# EAGLE design esp_car (EAGLE 9.0.1)
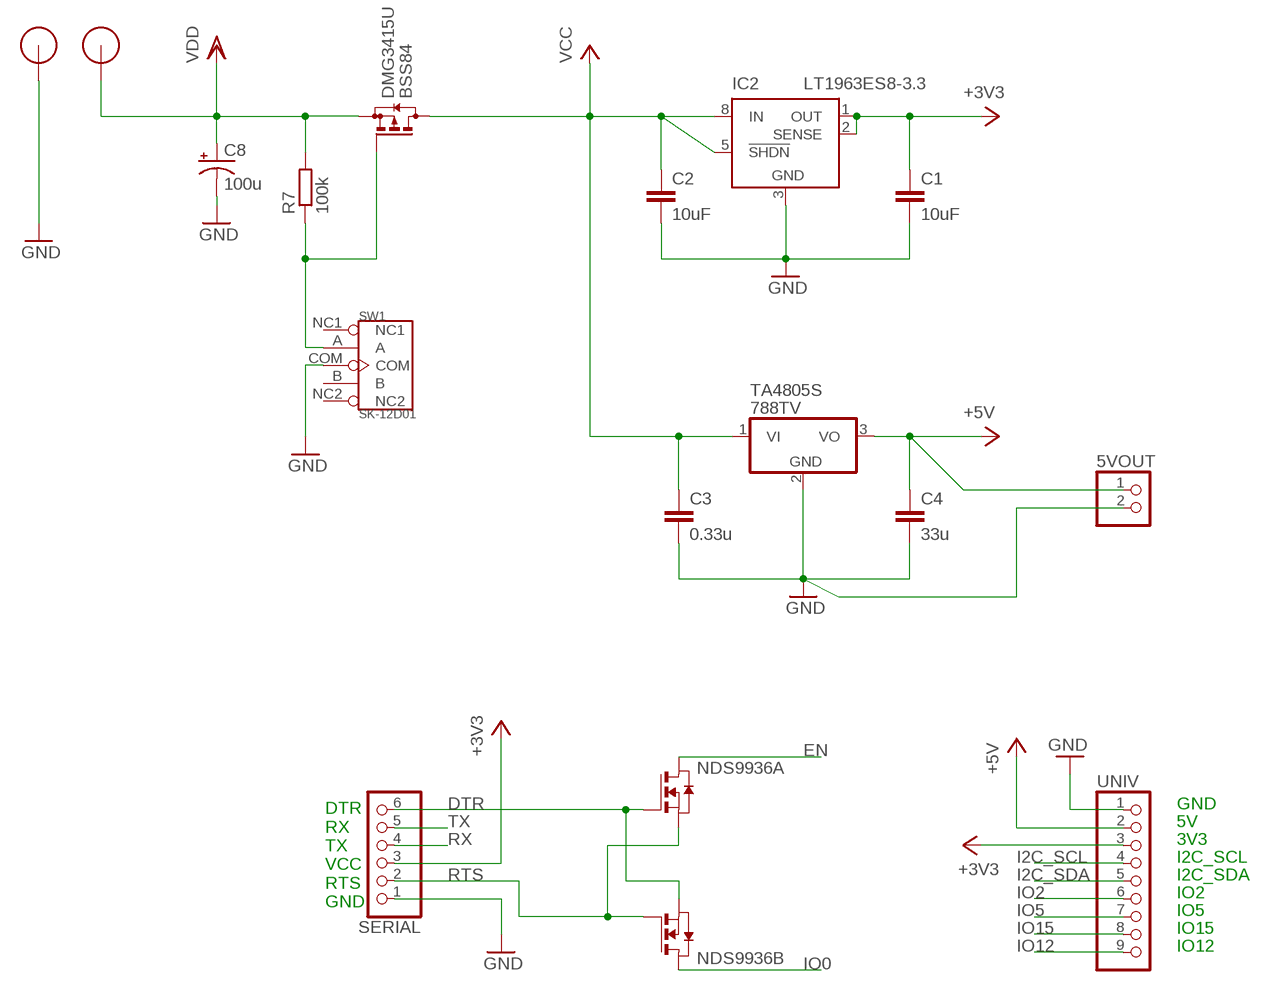
[diagram p0: schematic, sheet 1, part 1 of 2]
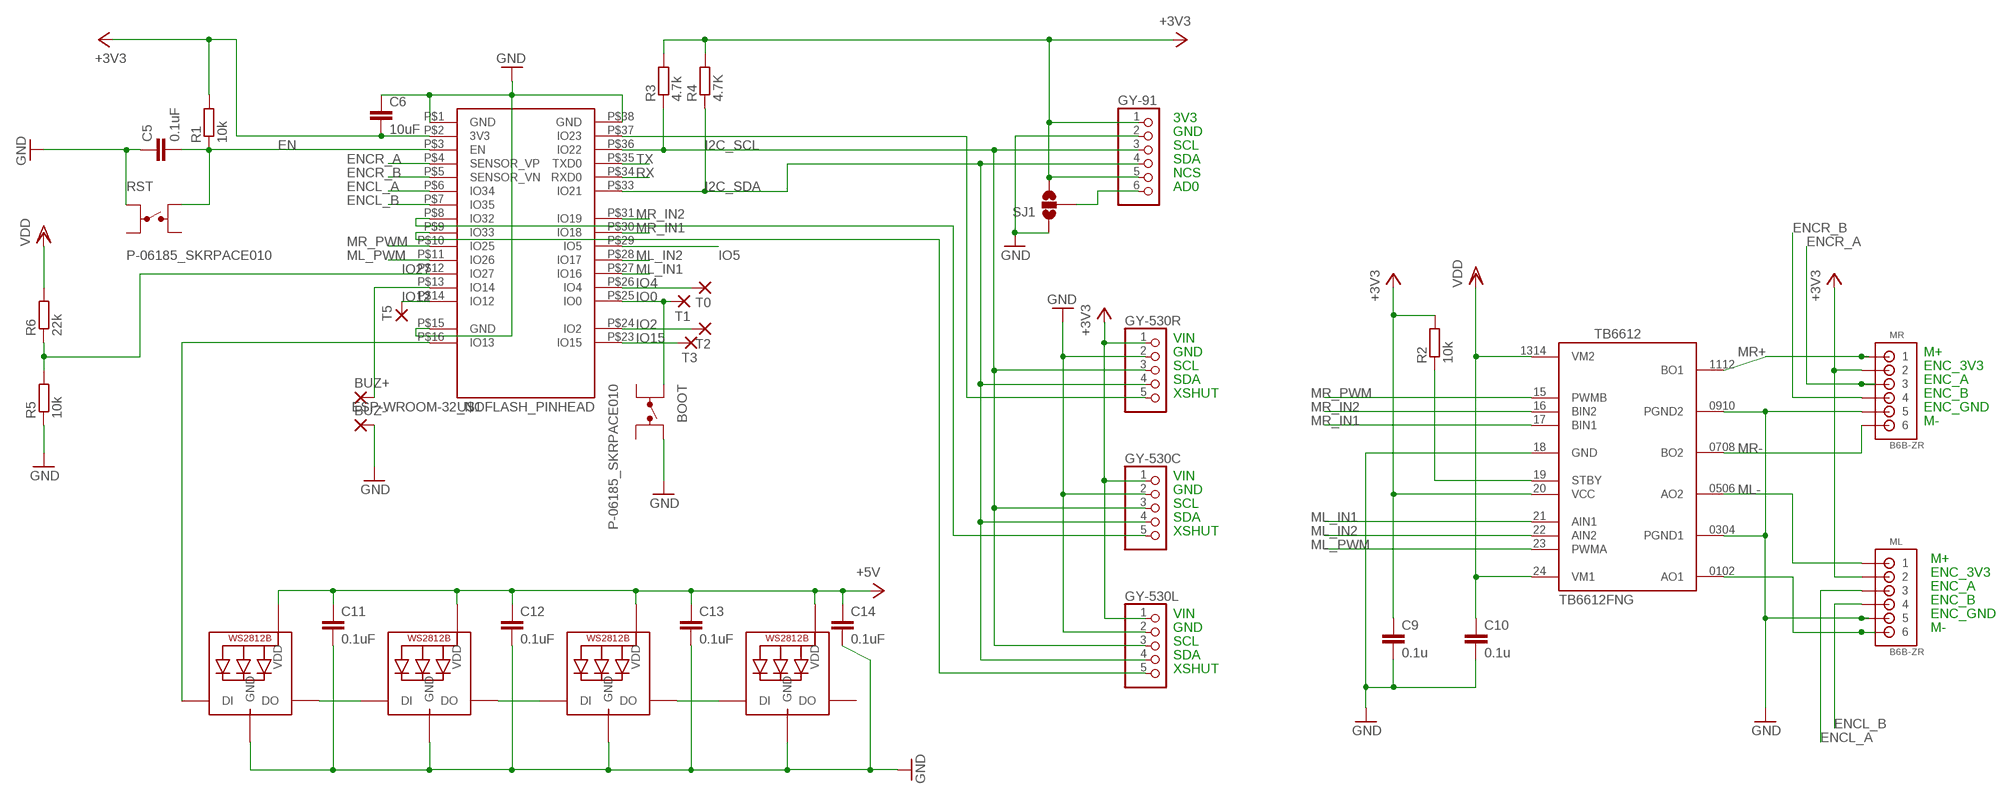
[diagram p1: schematic, sheet 1, part 2 of 2]

## Parts
5VOUT  PINHD-1X2  [1X02]
BOOT  P-06185_SKRPACE010  [SKRP]
BUZ+  SMD2  [SMD1,27-2,54]
BUZ-  SMD2  [SMD1,27-2,54]
C1  10uF  C-EUC1608  [C1608]
C2  10uF  C-EUC1608  [C1608]
C3  0.33u  C-EUC1608  [C1608]
C4  33u  C-EUC3225  [C3225]
C5  0.1uF  C-EUC1608  [C1608]
C6  10uF  C-EUC1608  [C1608]
C8  100u  CPOL-USE2.5-6  [E2,5-6]
C9  0.1u  C-EUC1608  [C1608]
C10  0.1u  C-EUC1608  [C1608]
C11  0.1uF  C-EUC1608  [C1608]
C12  0.1uF  C-EUC1608  [C1608]
C13  0.1uF  C-EUC1608  [C1608]
C14  0.1uF  C-EUC1608  [C1608]
DMG3415U  BSS84  [SOT23]
GY-91  PINHD-1X6  [1X06]
GY-530C  PINHD-1X5  [1X05]
GY-530L  PINHD-1X5  [1X05]
GY-530R  PINHD-1X5  [1X05]
IC2  LT1963ES8-3.3  [SOIC8]
LED_FL  WS2812B5050  [WS2812B]
LED_FR  WS2812B5050  [WS2812B]
LED_RL  WS2812B5050  [WS2812B]
LED_RR  WS2812B5050  [WS2812B]
ML  B6B-ZR  [B6B-ZR]
MR  B6B-ZR  [B6B-ZR]
NDS9936  NMOS2SO8  [SO8]
R1  10k  R-EU_R0603  [R0603]
R2  10k  R-EU_R0603  [R0603]
R3  4.7k  R-EU_R0603  [R0603]
R4  4.7K  R-EU_R0603  [R0603]
R5  10k  R-EU_R0603  [R0603]
R6  22k  R-EU_R0603  [R0603]
R7  100k  R-EU_R0603  [R0603]
RST  P-06185_SKRPACE010  [SKRP]
SERIAL  PINHD-1X6  [1X06]
SJ1  SOLDERJUMPER_2WAYS  [SJ_3]
SW1  SK-12D01  DIP-TOGGLE-SWITCH-ON-ON(3+2P-8.8X4.6MM)  [SW5-2.0-8.8X4.4X4.7MM-90D]
T0  SMD5  [SMD2,54-5,08]
T1  SMD5  [SMD2,54-5,08]
T2  SMD5  [SMD2,54-5,08]
T3  SMD5  [SMD2,54-5,08]
T5  SMD5  [SMD2,54-5,08]
TA4805S  788TV  [TO220V]
TB6612  TB6612_NEW  [SSOP24_TB6612]
U$1  ESP-WROOM-32_NOFLASH_PINHEAD  [ESP-WROOM-32_NOFLASH_PINHEAD]
U$5  2.0  [2.0]
U$7  2.0  [2.0]
UNIV  PINHD-1X9  [1X09-BIG]

## Nets
+3V3 [L]: C1.1 C6.2 C9.1 GY-91.1 GY-91.5 GY-530C.1 GY-530L.1 GY-530R.1 IC2.1(OUT) IC2.2(SENSE) ML.2 MR.2 R1.2 R2.2 R3.2 R4.2 SERIAL.3 SJ1.3 TB6612.20(VCC) U$1.P$2(3V3) UNIV.3
+5V [L]: 5VOUT.1 C4.1 C11.1 C12.1 C13.1 C14.1 LED_FL.1-VDD(VDD) LED_FR.1-VDD(VDD) LED_RL.1-VDD(VDD) LED_RR.1-VDD(VDD) TA4805S.3(VO) UNIV.2
DTR: NDS9936.2(A:G) NDS9936.3(B:S) SERIAL.6
EN: C5.2 NDS9936.7(A:D) NDS9936.8(A:D) R1.1 RST.2A(P$2A) U$1.P$3(EN)
ENCL_A: ML.3 U$1.P$6(IO34)
ENCL_B: ML.4 U$1.P$7(IO35)
ENCR_A: MR.3 U$1.P$4(SENSOR_VP)
ENCR_B: MR.4 U$1.P$5(SENSOR_VN)
GND [L]: 5VOUT.2 BOOT.2A(P$2A) BUZ-.1(P) C1.2 C2.2 C3.2 C4.2 C5.1 C6.1 C8.- C9.2 C10.2 C11.2 C12.2 C13.2 C14.2 GY-91.2 GY-530C.2 GY-530L.2 GY-530R.2 IC2.3(GND) LED_FL.3-GND(GND) LED_FR.3-GND(GND) LED_RL.3-GND(GND) LED_RR.3-GND(GND) ML.5 MR.5 R5.1 RST.1A(P$1A) SERIAL.1 SJ1.1 SW1.COM TA4805S.2(GND) TB6612.18(GND) TB6612.0304(PGND1) TB6612.0910(PGND2) U$1.P$1(GND) U$1.P$15(GND) U$1.P$38(GND) U$5.P$1 UNIV.1
I2C_SCL: GY-91.3 GY-530C.3 GY-530L.3 GY-530R.3 R3.1 U$1.P$36(IO22) UNIV.4
I2C_SDA: GY-91.4 GY-530C.4 GY-530L.4 GY-530R.4 R4.1 U$1.P$33(IO21) UNIV.5
IO0: BOOT.1A(P$1A) NDS9936.5(B:D) NDS9936.6(B:D) T1.1(P) U$1.P$25(IO0)
IO2: T2.1(P) U$1.P$24(IO2) UNIV.6
IO4: T0.1(P) U$1.P$26(IO4)
IO5: U$1.P$29(IO5) UNIV.7
IO12: T5.1(P) U$1.P$14(IO12) UNIV.9
IO15: T3.1(P) U$1.P$23(IO15) UNIV.8
IO27: R5.2 R6.1 U$1.P$12(IO27)
ML- [L]: ML.6 TB6612.0102(AO1)
ML_IN1: TB6612.21(AIN1) U$1.P$27(IO16)
ML_IN2: TB6612.22(AIN2) U$1.P$28(IO17)
ML_PWM: TB6612.23(PWMA) U$1.P$11(IO26)
MR+ [L]: MR.1 TB6612.1112(BO1)
MR- [L]: MR.6 TB6612.0708(BO2)
MR_IN1: TB6612.17(BIN1) U$1.P$30(IO18)
MR_IN2: TB6612.16(BIN2) U$1.P$31(IO19)
MR_PWM: TB6612.15(PWMB) U$1.P$10(IO25)
N$3: GY-530C.5 U$1.P$8(IO32)
N$4: GY-91.6 SJ1.2
N$5: GY-530R.5 U$1.P$37(IO23)
N$6: LED_FL.2-DOUT(DO) LED_RL.4-DIN(DI)
N$7: R2.1 TB6612.19(STBY)
N$8: BUZ+.1(P) U$1.P$13(IO14)
N$9: LED_RL.2-DOUT(DO) LED_RR.4-DIN(DI)
N$15: LED_FR.4-DIN(DI) LED_RR.2-DOUT(DO)
N$18: LED_FL.4-DIN(DI) U$1.P$16(IO13)
N$19: GY-530L.5 U$1.P$9(IO33)
N$38: ML.1 TB6612.0506(AO2)
N$39: DMG3415U.1(G) R7.1 SW1.A
RTS: NDS9936.1(A:S) NDS9936.4(B:G) SERIAL.2
RX: SERIAL.4 U$1.P$34(RXD0)
TX: SERIAL.5 U$1.P$35(TXD0)
VCC [LL]: C2.1 C3.1 DMG3415U.3(D) IC2.5(!SHDN) IC2.8(IN) TA4805S.1(VI)
VDD [L]: C8.+ C10.1 DMG3415U.2(S) R6.2 R7.2 TB6612.24(VM1) TB6612.1314(VM2) U$7.P$1
Unconnected: BOOT.1B(P$1B) BOOT.2B(P$2B) IC2.4(NC) LED_FR.2-DOUT(DO) RST.1B(P$1B) RST.2B(P$2B) SW1.B SW1.NC1 SW1.NC2

## Notes on the sheet
- 3V3
- GND
- SCL
- SDA
- NCS
- AD0
- VIN
- GND | M+
- SCL | ENC_3V3
- SDA | ENC_A
- XSHUT | ENC_B
- ENC_GND
- M-
- VIN
- GND
- SCL
- SDA
- XSHUT
- M+
- ENC_3V3
- ENC_A
- ENC_B
- GND | VIN | ENC_GND
- 5V | GND | M-
- 3V3 | SCL
- I2C_SCL | SDA
- I2C_SDA | XSHUT
- IO2
- DTR
  RX
  TX
  VCC
  RTS
  GND
- IO5
- IO15
- IO12

## Power pins joined to a net without a drawn wire
GND: IC2.6(GND) IC2.7(GND)

## Library data of the parts
5VOUT = pinhead:PINHD-1X2: PIN HEADER
BOOT RST = Akizuki:P-06185_SKRPACE010
BUZ+ BUZ- = wirepad:SMD2: SMD PAD
C1-C6 C9-C14 = rcl:C-EU: CAPACITOR, European symbol; SPICEPREFIX: C
C8 = rcl:CPOL-US: POLARIZED CAPACITOR, American symbol
DMG3415U = transistor-small-signal:BSS84: P-CHANNEL MOS FET
GY-91 SERIAL = adafruit:PINHD-1X6: PIN HEADER
GY-530C GY-530L GY-530R = pinhead:PINHD-1X5: PIN HEADER
IC2 = linear-technology:LT1963ES8: 1.5A, Low Noise, Fast Transient Response LDO Regulator Source: http://www.linear.com/pc/downloadDocument.do?navId=H0,C3,P2222,D3148; MPN: LT1963ES8-3.3; OC_FARNELL: unknown; OC_NEWARK: 57M7563
LED_FL LED_FR LED_RL LED_RR = adafruit:WS2812B
ML MR = jst:B6B-ZR: JST-ZH Connector 6 pol, 1.5mm pitch Package: B6B-ZR Source: http://www.jst-mfg.com/product/pdf/eng/eZH.pdf
NDS9936 = zetex:NMOS2: Dual MOS FET; OC_FARNELL: unknown; OC_NEWARK: unknown
R1-R7 = rcl:R-EU_: RESISTOR, European symbol; SPICEPREFIX: R
SJ1 = SparkFun:SOLDERJUMPER_2WAY: Solder Jumper 2 way solder jumper
SW1 = Seeed-OPL-Button:DIP-TOGGLE-SWITCH-ON-ON(3+2P-8.8X4.6MM): 311030008; MPN: SK-12D01
T0 T1-T3 T5 = wirepad:SMD5: SMD PAD
TA4805S = linear:78*: Positive VOLTAGE REGULATOR Source: http://cache.national.com/ds/LM/LM78L05.pdf http://www.fairchildsemi.com/ds/LM/LM7805.pdf
TB6612 = adafruit_my:TB6612_NEW
U$1 = esp32 _my:ESP-WROOM-32_NOFLASH_PINHEAD
U$5 U$7 = Mount_pad:2.0
UNIV = adafruit:PINHD-1X9: Pin header 1x10 0.1" spacing With round pins

## Net classes
0 default: width 0.305 mm, drill 0.203 mm, clearance 0.152 mm
1 L: width 1.016 mm, drill 0.813 mm, clearance 0.152 mm
2 LL: width 1.524 mm, drill 1.321 mm, clearance 0.152 mm

## Board
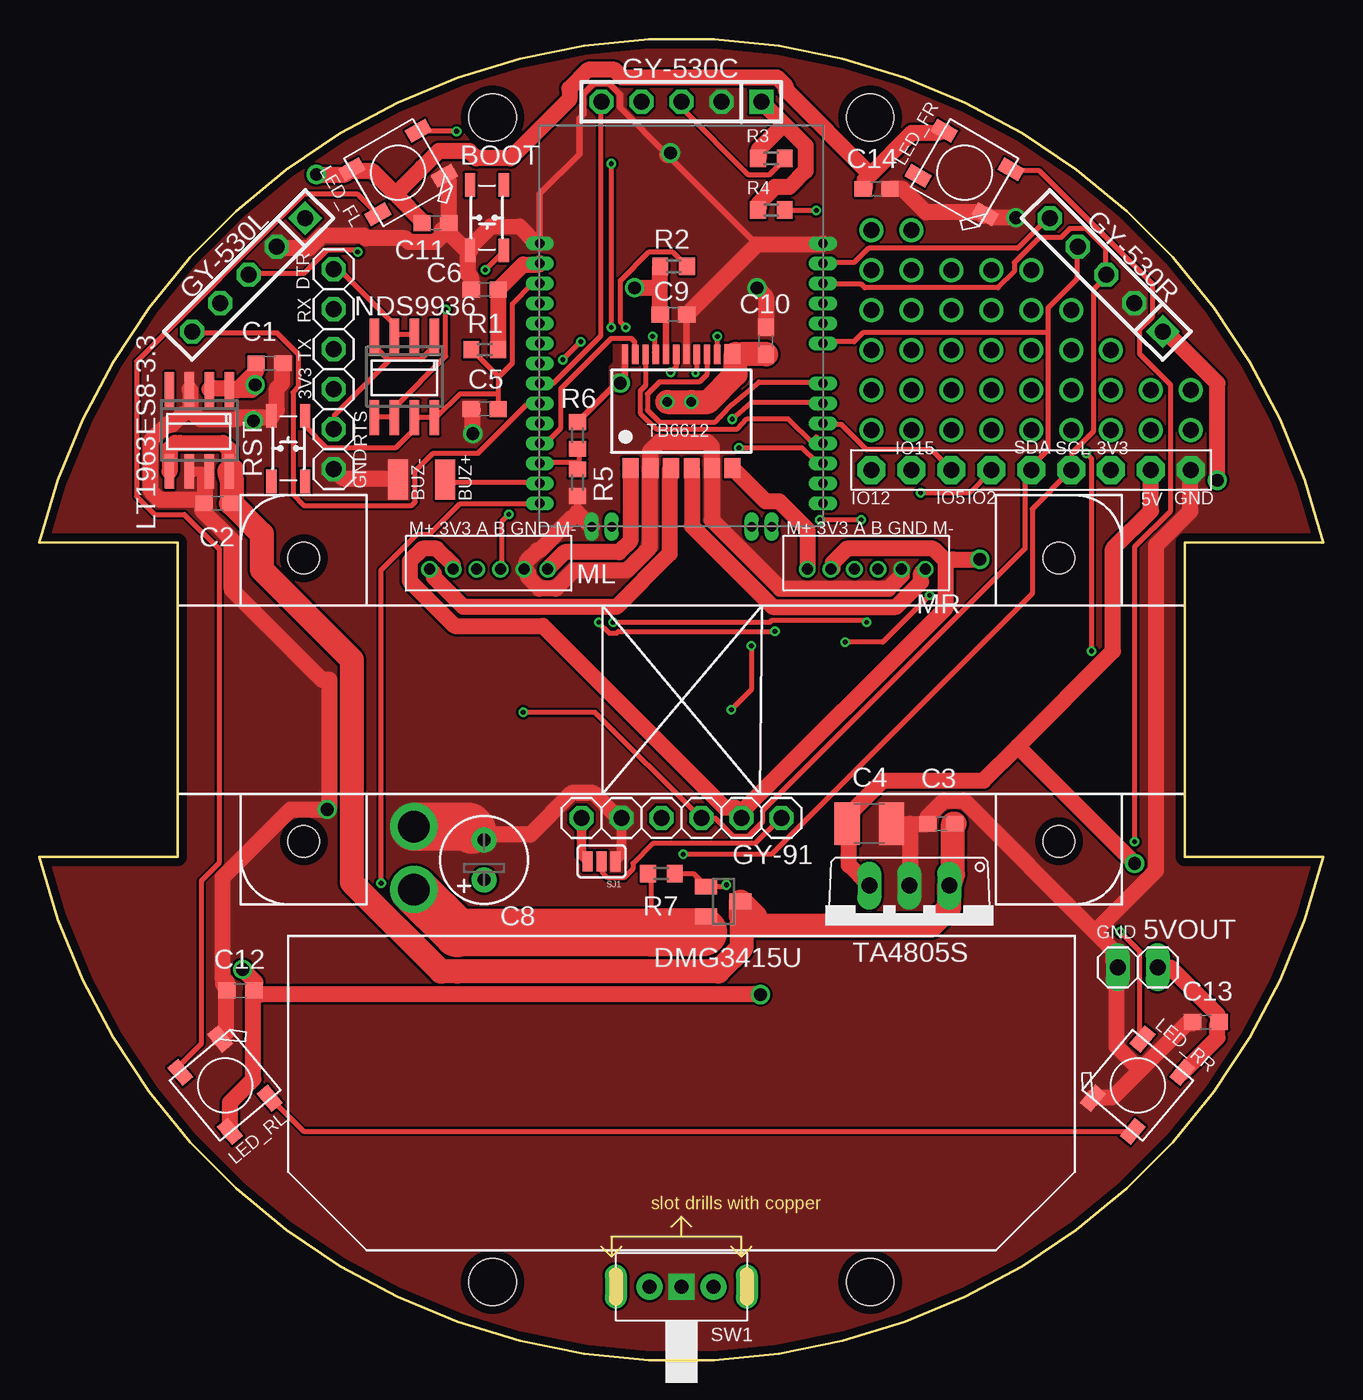
[diagram p2: board, top side]
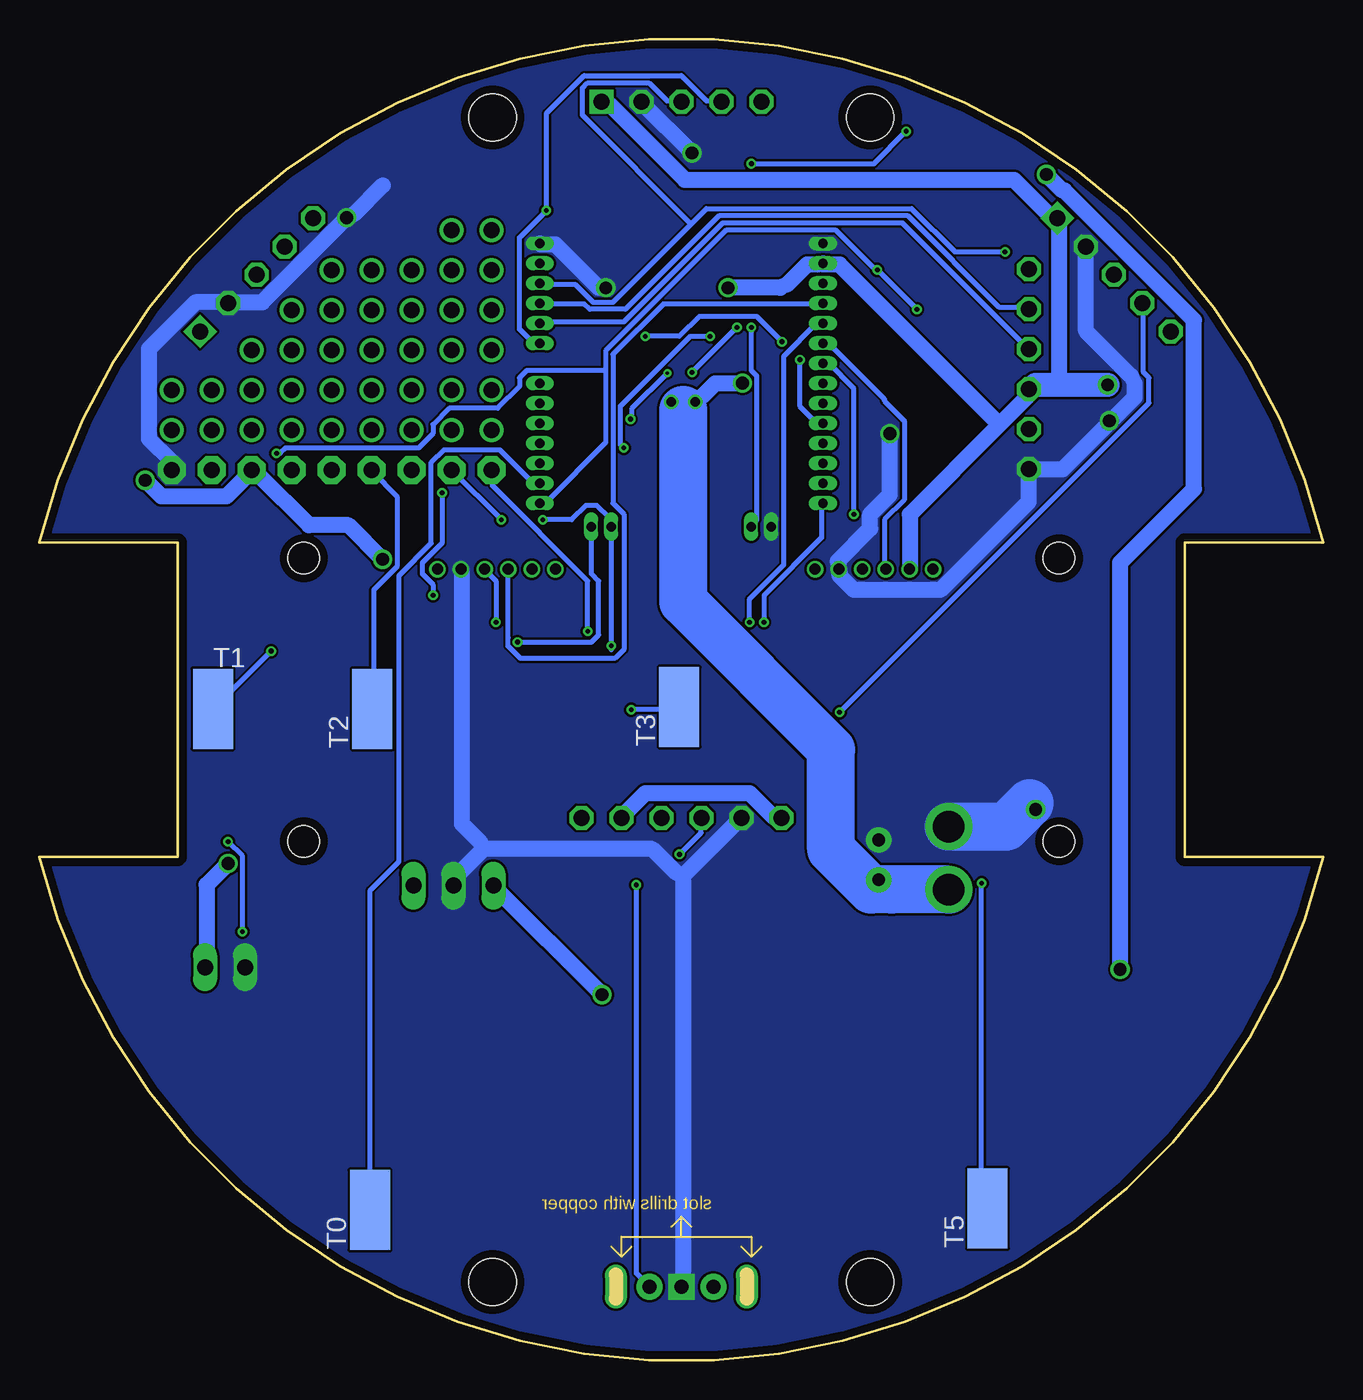
[diagram p3: board, bottom side, seen from below]

Size 81.6 x 83.94 mm. Coordinates in mm from the lower left corner, seen from the top.
Outline: 0,51.97 8.8,51.97 8.8,31.97 0,31.97 arc152 81.6,31.97 72.8,31.97 72.8,51.97 81.6,51.97 arc152 0,51.97
Copper layers (1*16): Top 0.035mm / dielectric 1.6mm / Bottom 0.035mm
Design rules "Elecrow_2-layer_PCB_eagle_rule": minimum track width 6mil, minimum drill 12mil, track to track 6mil, track to pad 8mil, pad to pad 12mil, via to via 12mil, smd to smd 0mil, copper to edge 20mil, drill to drill 10mil, minimum pad ring 6mil, minimum via ring 6mil, stop-mask expansion 0mil, vias tented up to drill 100mil, thermal gap 10mil
Holes 2 mm at 16.8,50.97 16.8,32.97 64.8,32.97 64.8,50.97
Holes 3 mm at 28.8,78.97 52.8,78.97 28.8,4.97 52.8,4.97

### Footprints (pad centres in the part's own frame; a part is rotated, then mirrored left to right if it is on the bottom)
1X02 = drill 1.016 long: 1 -1.27,0; 2 1.27,0
SKRP = smd 1.5 x 0.65: 1A -2.075,-1.075; 1B 2.075,-1.075; 2A -2.075,1.075; 2B 2.075,1.075
SMD1,27-2,54 = smd 1.27 x 2.54: 1 0,0
C1608 = smd 1.1 x 1: 1 -0.85,0; 2 0.85,0
C3225 = smd 1.6 x 2.7: 1 -1.4,0; 2 1.4,0
E2,5-6 = drill 0.8 pad 1.6: + -1.27,0; - 1.27,0
SOT23 = smd 1 x 1.4: 1 -0.95,-1.1; 2 0.95,-1.1; 3 0,1.1
1X06 = drill 1.016 octagon: 1 -6.35,0; 2 -3.81,0; 3 -1.27,0; 4 1.27,0; 5 3.81,0; 6 6.35,0
1X05 = drill 1.016 square: 1 -5.08,0 | drill 1.016 octagon: 2 -2.54,0; 3 0,0; 4 2.54,0; 5 5.08,0
SOIC8 = smd 0.6 x 2.2: 1 -1.905,-2.6; 2 -0.635,-2.6; 3 0.635,-2.6; 4 1.905,-2.6; 5 1.905,2.6; 6 0.635,2.6; 7 -0.635,2.6; 8 -1.905,2.6
WS2812B = smd 1.5 x 0.9: 1-VDD 2.45,-1.65; 2-DOUT 2.45,1.65; 3-GND -2.45,1.65; 4-DIN -2.45,-1.65
B6B-ZR = drill 0.7: 1 9,-1.3; 2 7.5,-1.3; 3 6,-1.3; 4 4.5,-1.3; 5 3,-1.3; 6 1.5,-1.3
SO8 = smd 0.6 x 2.2: 1 -1.905,-2.6; 2 -0.635,-2.6; 3 0.635,-2.6; 4 1.905,-2.6; 5 1.905,2.6; 6 0.635,2.6; 7 -0.635,2.6; 8 -1.905,2.6
R0603 = smd 1 x 1.1: 1 -0.85,0; 2 0.85,0
SJ_3 = smd 0.635 x 1.27: 1 -0.889,0; 2 0,0; 3 0.889,0
SW5-2.0-8.8X4.4X4.7MM-90D = drill 0.889 pad 1.651: A 0,2.032; B 0,-2.032 | drill 0.889 pad 1.651 square: COM 0,0 | drill 0.762 pad 1.397 long: NC1 0,4.166; NC2 0,-4.166
SMD2,54-5,08 = smd 2.54 x 5.08: 1 0,0
TO220V = drill 1.016 long: 1 -2.54,-2.54; 2 0,-2.54; 3 2.54,-2.54
SSOP24_TB6612 = smd 0.4 x 1.25: 15 2.275,3.625; 16 1.625,3.625; 17 0.975,3.625; 18 0.325,3.625; 19 -0.325,3.625; 20 -0.975,3.625; 21 -1.625,3.625; 22 -2.275,3.625; 23 -2.925,3.625; 24 -3.575,3.625 | smd 1.016 x 1.27: 0102 -3.245,-3.625; 0304 -1.96,-3.625; 0506 -0.649,-3.625; 0708 0.661,-3.625; 0910 1.946,-3.625; 1112 3.256,-3.625; 1314 3.246,3.639
ESP-WROOM-32_NOFLASH_PINHEAD = drill 0.6 pad 0.9 long: P$1 0,18; P$2 0,16.73; P$3 0,15.46; P$4 0,14.19; P$5 0,12.92; P$6 0,11.65; P$7 0,10.38; P$8 0,9.11; P$9 0,7.84; P$10 0,6.57; P$11 0,5.3; P$12 0,4.03; P$13 0,2.76; P$14 0,1.49; P$15 3.3,0; P$16 4.57,0; P$23 13.46,0; P$24 14.73,0; P$25 18,1.49; P$26 18,2.76; P$27 18,4.03; P$28 18,5.3; P$29 18,6.57; P$30 18,7.84; P$31 18,9.11; P$33 18,11.65; P$34 18,12.92; P$35 18,14.19; P$36 18,15.46; P$37 18,16.73; P$38 18,18
2.0 = drill 2: P$1 0,0
1X09-BIG = drill 1.016 pad 1.778 octagon: 1 -10.16,0; 2 -7.62,0; 3 -5.08,0; 4 -2.54,0; 5 0,0; 6 2.54,0; 7 5.08,0; 8 7.62,0; 9 10.16,0

### Placement (x,y rotation side)
5VOUT  69.8,24.97 180 top
BOOT  28.45,72.61 90 top
BUZ+  25.8,55.97 0 top
BUZ-  22.8,55.97 180 top
C1  14.63,63.35 0 top
C2  11.33,54.46 180 top
C3  57.32,34.09 180 top
C4  52.74,34.1 0 top
C5  28.3,60.45 0 top
C6  28.3,68.03 0 top
C8  28.26,31.79 90 top
C9  40.3,66.45 0 top
C10  46.18,64.78 90 top
C11  25.18,72.26 0 top
C12  12.78,23.5 180 top
C13  74.13,21.5 180 top
C14  53.2,74.44 0 top
DMG3415U  43.47,29.15 270 top
GY-91  40.8,34.47 0 top
GY-530C  40.8,79.97 180 top
GY-530L  13.3,68.97 225 top
GY-530R  67.8,68.97 135 top
IC2  10.17,59.08 180 top
LED_FL  22.8,75.47 210 top
LED_FR  58.8,75.47 150 top
LED_RL  11.8,17.47 310 top
LED_RR  69.8,17.47 50 top
ML  33.8,48.97 180 top
MR  57.8,48.97 180 top
NDS9936  23.2,62.5 180 top
R1  28.3,64.22 0 top
R2  40.31,69.51 180 top
R3  46.52,76.37 180 top
R4  46.52,73.09 180 top
R5  34.2,55.77 90 top
R6  34.2,58.77 90 top
R7  39.53,30.93 180 top
RST  15.82,57.94 270 top
SERIAL  18.7,62.98 90 top
SJ1  35.73,31.7 180 top
SW1  40.8,4.67 270 top
T0  60.59,9.54 0 bottom
T1  70.55,41.39 0 bottom
T2  60.45,41.39 0 bottom
T3  40.94,41.51 0 bottom
T5  21.34,9.64 0 bottom
TA4805S  55.28,27.62 180 top
TB6612  40.8,60.3 0 top
U$1  31.8,52.97 0 top
U$5  23.8,33.91 0 top
U$7  23.8,29.91 0 top
UNIV  63.03,56.58 180 top

### Tracks (layer width: path | path; a pad name or v marks a point on that pad's centre or on a via)
+3V3  (via drill 0.81)
  Top 0.406: TB6612.20 39.82,66.07 C9.1
  Top 0.61: GY-91.1 34.45,32.09 SJ1.3
  Top 1.016: v74.87,55.92 74.87,62.09 71.67,65.29 71.44,65.29 GY-530R.1 | 57.61,50.78 56.81,51.58 51.32,51.58 50.41,50.66 50.41,50.32 MR.2 | 57.61,50.78 57.61,47.8 44.69,34.89 44.69,34.54 GY-91.5 44.23,35.12 43.55,35.12 32,46.66 26.4,46.66 23.55,49.52 23.55,50.78 24.35,51.58 25.26,51.58 26.29,50.55 26.29,50.32 ML.2 | v59.78,50.89 58.06,50.89 57.61,50.78 | IC2.2 10.86,61.75 12,61.75 IC2.1 | IC2.1 12.57,61.63 13.37,62.43 | R1.2 29.15,64.26 29.15,67.92 C6.2 29.49,68.38 30.75,69.64 31.78,69.64 U$1.P$2 | 13.37,62.43 13.78,62.84 C1.1 | 39.43,68.15 39.43,66.55 C9.1 | 39.43,68.15 39.43,69.41 R2.2 | v37.83,68.15 39.43,68.15 | 13.37,62.43 13.72,62.09 v13.72,61.98 13.5,61.66 IC2.1 | 47.32,78.55 45.95,79.92 GY-530C.1 | 47.32,78.55 48.69,77.18 48.69,75.58 47.66,74.55 46.75,74.55 45.72,73.52 45.72,73.18 R4.2 | 47.32,78.55 45.72,76.95 45.72,76.38 R3.2
  Bottom 1.016: v74.87,55.92 73.84,54.89 69.72,54.89 68.12,56.49 UNIV.3 67.66,56.26 64.47,53.06 61.95,53.06 v59.78,50.89 | GY-91.1 34.52,34.54 34.98,34.54 36.46,36.03 43.09,36.03 44.58,34.54 GY-91.5 | 18.63,61.63 SERIAL.3 | 20.57,59.46 18.86,61.18 SERIAL.3 | 20.57,59.46 26.29,53.75 26.29,50.32 ML.2 | 20.57,59.46 30.75,69.64 31.78,69.64 U$1.P$2 32.23,69.64 32.8,69.64 34.06,68.38 34.52,68.15 v37.83,68.15 | 45.95,80.04 GY-530C.1 45.38,79.81 40.58,75.01 19.66,75.01 17.37,72.72 16.92,72.61 GY-530L.1 16.8,72.04 16.8,61.98 | 16.8,61.98 18.29,61.98 SERIAL.3 | 16.8,61.98 v13.72,61.98
  Bottom 1.524: v13.72,61.98 18.29,61.98
+5V  (via drill 0.81)
  Top 1.016: 22.63,74.09 21.14,75.58 19.89,75.58 LED_FL.1-VDD 19.43,75.35 v17.6,75.35 | 57.49,78.09 LED_FR.1-VDD 57.04,77.98 55.43,77.98 52.81,75.35 | LED_RR.1-VDD 72.69,18.31 74.87,20.49 74.87,21.4 C13.1 74.87,21.97 71.89,24.94 71.09,24.94 5VOUT.1 | C12.1 13.6,23.46 13.6,17.86 12.12,16.37 12.12,14.54 LED_RL.1-VDD | TA4805S.3 52.69,30.2 51.43,31.46 51.43,34.09 C4.1 51.66,34.54 51.66,34.89 53.61,36.83 60.01,36.83 62.18,39 | 62.18,39 68.24,45.06 68.24,51.58 70.64,53.98 70.64,56.49 UNIV.2 | v45.83,23.23 14.06,23.23 C12.1 | 62.18,39 v69.61,31.57 | v12.92,24.83 13.72,24.03 C12.1 | 22.63,74.09 24.25,75.71 24.26,75.75 24.32,75.78 25.38,76.84 27.32,76.84 27.78,76.38 29.95,76.38 33.69,80.12 33.69,80.81 34.88,82 36.56,82 37.04,81.52 46.86,81.52 47.43,80.95 47.43,80.72 52.81,75.35 | 22.63,74.09 24.33,72.39 C11.1 | 52.81,75.35 52.46,75.01 52.46,74.44 C14.1
  Bottom 1.016: v45.83,23.23 52.69,30.09 TA4805S.3 | v69.61,31.57 70.98,30.2 70.98,25.06 5VOUT.1 | v17.6,75.35 16.57,74.32 16.46,74.32 8.23,66.09 8.23,55.36 12.92,50.67 v12.92,24.83
DTR
  Top 0.305: NDS9936.2 23.77,65.18 22.63,65.18 NDS9936.3 22.63,65.29 22.63,65.75 19.09,69.29 18.75,69.29 SERIAL.6
EN
  Top 0.305: RST.2A 16.92,59.92 16.92,59.35 18.29,57.98 22.63,57.98 23.77,59.12 23.77,59.81 NDS9936.7 23.89,59.92 25.03,59.92 NDS9936.8 25.26,59.92 26.75,61.41 29.15,61.41 | 29.15,62.55 29.15,61.41 | 29.15,61.41 29.15,60.49 C5.2 | 29.15,62.55 27.55,64.15 R1.1 | U$1.P$3 31.78,68.38 31.32,68.38 30.06,67.12 30.06,63.35 29.26,62.55 29.15,62.55
ENCL_A
  Bottom 0.305: U$1.P$6 31.78,64.61 31.43,64.61 27.89,61.06 27.89,60.95 26.63,59.69 26.63,54.66 27.89,53.4 27.89,50.43 ML.3 27.89,50.32
ENCL_B  (via drill 0.3)
  Top 0.305: v29.83,53.75 29.38,53.29 29.38,50.32 ML.4
  Bottom 0.305: U$1.P$7 31.78,63.35 31.43,63.35 29.83,61.75 v29.83,53.75 | 29.38,50.32 ML.4
ENCR_A
  Bottom 0.305: U$1.P$4 31.89,67.12 41.95,67.12 45.15,63.92 45.15,54.45 44.45,53.76 44.45,45.16 45.02,44.59 51.03,44.59 51.82,45.38 51.82,45.88 51.8,45.9 MR.3
ENCR_B  (via drill 0.3)
  Top 0.305: v36.46,46.89 46.41,46.89 46.52,47 52.46,47 v52.58,46.89
  Bottom 0.305: v36.46,46.89 36.46,48.38 34.29,50.55 34.29,63.81 32.23,65.86 31.89,65.86 U$1.P$5 | v52.58,46.89 52.58,49.52 53.26,50.2 MR.4
GND  (via drill 0.81)
  Top 0.305: 27.47,33.72 28.13,33.06 C8.- | C9.2 41.25,66.55 41.26,66.55
  Top 0.356: TB6612.18
  Top 0.406: 34.2,53.87 R5.1 | U$1.P$1 31.8,74.12 34.33,76.65 34.33,78.93 34.58,79.19 34.58,79.46 34.55,79.49 34.55,80.45 35.24,81.14 36.2,81.14 36.89,80.45 36.89,79.61 39.89,76.61 45.61,70.89 | TB6612.18 41.12,66.42 C9.2
  Top 0.61: SJ1.1 36.99,32.07 GY-91.2 | IC2.6 IC2.7 10.81,56.44 10.52,56.15
  Top 1.016: MR.5 54.8,49.87 53.96,49.03 47.1,49.03 42.75,53.39 TB6612.0910 42.75,58.07 42.46,58.36 39.41,58.36 38.84,57.79 TB6612.0304 38.77,56.61 38.77,51.62 37.34,50.19 33.96,50.19 32.81,49.03 31.79,49.03 31.06,49.76 31.06,50.01 ML.5 30.98,50.78 31.66,51.46 31.78,51.46 33.83,53.52 34.29,53.75 | 34.29,53.75 35.09,52.95 U$1.P$15 | 34.29,53.75 34.2,53.87 | BUZ-.1 22.75,56.03 19.32,56.03 18.75,56.6 SERIAL.1 | LED_FL.3-GND 25.72,75.24 26.03,74.92 C11.2 | 13.6,59.92 12.69,59.92 12.57,59.81 10.17,59.81 9.6,60.38 | 13.6,59.92 14.75,59.92 RST.1A 15.09,60.38 15.09,61.75 15.43,62.09 15.43,63.35 C1.2 | 9.6,60.38 9.6,61.63 IC2.3 | C12.2 11.89,23.46 11.89,20.83 11.54,20.49 LED_RL.3-GND | 10.52,56.15 10.52,54.66 10.33,54.66 | 11.66,23.92 C12.2 | 10.33,54.66 7.66,54.66 7.09,55.23 7.09,58.43 8.12,59.46 8.46,59.46 9.14,60.15 9.6,60.38 | v13.6,59.69 13.6,59.92 | v45.61,68.15 46.18,67.58 C10.2 | 41.26,66.55 45.61,70.89 49.72,70.89 U$1.P$38 | 60.01,72.72 LED_FR.3-GND | v62.06,72.61 60.58,72.61 LED_FR.3-GND | 28.23,33.17 C8.- 28.69,33.4 31.2,33.4 33.83,36.03 35.2,36.03 36.69,34.54 GY-91.2 | 69.95,18.43 68.24,16.71 66.98,16.71 LED_RR.3-GND | 69.95,18.43 72.92,21.4 73.27,21.4 C13.2 | 69.95,18.43 68.47,19.91 68.47,24.94 5VOUT.2 68.24,25.4 68.24,26.09 67.09,27.23 | 55.32,34.09 54.18,34.09 C4.2 | 55.32,34.09 C3.2 56.46,34.54 57.49,35.57 58.75,35.57 67.09,27.23 | 55.32,34.09 55.32,30.2 TA4805S.2 | 67.09,27.23 70.98,31.12 70.98,51.8 73.15,53.98 73.15,56.49 UNIV.1 | 27.2,70.44 27.2,69.06 27.43,68.83 27.43,68.03 C6.1 | 27.2,70.44 BOOT.2A 27.55,70.89 28.69,72.04 30.5,72.06 31.53,71.03 31.78,71.01 U$1.P$1
  Top 1.016: v27.55,58.89 27.55,60.38 C5.1 | C12.2 11.93,24.02 11.65,24.3 11.65,30.67 15.96,34.99 18.27,34.99 v18.29,35 18.43,35.14 18.43,43.24 17.95,43.24 12.23,48.96 12.23,52.13 10.33,54.04 C2.2 10.33,54.67 10.33,54.66 | C11.2 26.03,71.61 27.2,70.44 | C11.2 25.59,71.82 25.59,71.47 25.18,71.05 23.48,71.05 23.25,71.29 20.76,71.29 20.59,71.46 17.95,71.46 17.14,70.66 15.54,70.66 15.09,70.78 GY-530L.2 | C14.2 54.86,74.44 56.35,72.95 59.55,72.95 LED_FR.3-GND | v40.12,76.72 40,76.72 39.89,76.61
  Top 3.048: U$5.P$1 27.28,33.91 27.47,33.72
  Bottom 1.016: 13.54,59.63 12,61.18 12,62.09 12.23,62.55 15.09,65.41 15.09,70.66 GY-530L.2 | 13.54,59.63 16.57,56.6 18.17,56.6 SERIAL.1 18.75,56.6 18.75,54.55 24.35,48.95 29.83,48.95 30.75,49.86 30.75,50.2 ML.5 30.86,50.78 28.8,52.83 28.8,53.75 27.55,55 v27.55,58.89 | v13.6,59.69 13.54,59.63 | v45.61,68.15 46.06,68.15 48.81,70.89 49.72,70.89 U$1.P$38 | 59.78,74.66 61.61,72.84 v62.06,72.61 67.44,67.23 69.49,67.23 GY-530R.2 70.07,67.23 71.67,67.23 74.64,64.26 74.64,58.55 73.27,57.18 73.27,56.6 UNIV.1 | 40.69,30.77 40.69,4.71 SW1.COM | 40.69,30.77 37.03,34.43 GY-91.2 | 53.38,32.49 55.21,30.66 55.21,30.2 TA4805S.2 | 53.38,32.49 42.63,32.49 41.15,31 40.69,30.77 | MR.5 54.75,50.2 54.75,34.09 53.61,32.94 53.38,32.49 | v40.12,76.72 43.32,79.92 GY-530C.2
  Bottom 3.048: U$5.P$1 20.15,33.91 18.67,35.39
  pour Top (no thermals): -4.28,78.17 -4.28,-4.38 84.62,-4.38 84.62,89.6 65.57,89.6 -4.28,89.6
  pour Bottom (no thermals): -3.01,81.98 -3.01,-3.11 90.97,-3.11 90.97,85.79 -3.01,85.79
I2C_SCL  (via drill 0.3)
  Top 0.305: v40.92,32.14 46.52,32.14 63.09,48.72 63.09,54.09 65.49,56.49 UNIV.4 65.61,56.72 65.61,57.63 66.98,59.01 66.98,68.03 67.78,68.83 GY-530R.3 67.78,69.06 67.78,70.66 66.52,71.92 65.49,71.92 64.92,71.35 63.55,71.35 61.95,69.75 61.95,69.18 60.92,68.15 52.46,68.15 52.23,68.38 49.83,68.38 U$1.P$36 | R3.1 47.32,76.26 46.41,75.35 45.03,75.35 40.8,79.58 40.8,79.92 GY-530C.3 | v20.23,70.44 20.12,70.55 18.29,70.55 16.8,69.06 13.37,69.06 GY-530L.3
  Bottom 0.305: v40.92,32.14 39.55,33.52 39.55,34.43 GY-91.3 | v20.23,70.44 23.43,70.44 26.18,73.18 39.2,73.18 40.18,72.21 | 40.18,72.21 45.15,67.23 46.41,67.23 47.55,68.38 49.72,68.38 U$1.P$36 | 40.18,72.21 47.09,79.12 47.09,80.84 46.75,81.18 42.86,81.18 41.72,80.04 40.8,80.04 GY-530C.3
I2C_SDA  (via drill 0.3)
  Top 0.305: v49.38,73.06 47.43,73.06 R4.1 | v30.75,41.17 35.32,41.17 41.95,34.54 GY-91.4 42.18,34.43 42.98,34.43 44.12,33.29 45.03,33.29 45.95,34.2 45.95,34.89 62.64,51.58 62.64,56.15 62.98,56.49 UNIV.5 62.98,56.72 64.12,57.86 64.12,65.29 | 64.12,65.29 64.12,66.89 65.95,68.72 65.95,70.66 GY-530R.4 | 64.12,65.29 52.35,65.29 51.78,64.72 49.83,64.72 U$1.P$33
  Bottom 0.305: U$1.P$33 49.83,64.72 50.29,64.72 51.09,65.52 51.09,71.35 v49.38,73.06 49.38,79.24 46.98,81.64 40.8,81.64 39.2,80.04 38.29,80.04 GY-530C.4 | v30.75,41.17 11.09,60.83 11.09,62.43 11.43,62.78 11.43,67.12 GY-530L.4
IO0  (via drill 0.3)
  Top 0.305: v28.35,69.29 29.49,70.44 BOOT.1A | v25.83,66.78 25.83,63.81 22.63,60.61 22.63,59.92 NDS9936.6 22.52,59.92 21.37,59.92 NDS9936.5 | v66.86,45.06 66.86,57.29 v66.52,57.63
  Bottom 0.305: v25.83,66.78 v28.35,69.29 28.46,69.29 30.98,71.81 37.95,71.81 45.61,64.15 45.61,62.89 | 45.61,62.89 45.61,58.32 49.38,54.55 49.72,54.55 U$1.P$25 | v66.86,45.06 70.52,41.4 T1.1 | v66.52,57.63 66.29,57.63 65.95,57.98 57.49,57.98 56.58,58.89 56.58,59.46 55.55,60.49 52.46,60.49 51.09,61.86 51.09,62.43 50.63,62.89 45.61,62.89
IO2  (via drill 0.3)
  Top 0.305: v51.21,45.63 53.61,45.63 v56.58,48.6 | v56.01,55.12 59.09,55.12 60.46,56.49 UNIV.6
  Bottom 0.305: v51.21,45.63 46.52,45.63 46.06,46.09 46.06,49.52 46.52,49.98 46.52,52.95 U$1.P$24 | v56.58,48.6 56.58,49.29 57.26,49.98 57.26,50.66 56.01,51.92 v56.01,55.12 | T2.1 60.35,41.4 60.35,48.95 58.86,50.43 58.86,54.89 60.46,56.49 UNIV.6
IO4
  Bottom 0.305: U$1.P$26 49.83,55.8 50.29,55.8 52.35,57.86 55.89,57.86 56.69,57.06 56.69,51.92 58.75,49.86 58.75,31.69 60.58,29.86 60.58,9.63 T0.1
IO5
  Top 0.305: U$1.P$29 49.83,59.46 50.98,59.46 52.58,57.86 56.69,57.86 57.95,56.6 UNIV.7
IO12  (via drill 0.3)
  Top 0.305: v21.72,30.32 21.72,50.2 24,52.49 24.8,52.49 26.75,54.43 31.78,54.43 U$1.P$14 | v46.75,46.32 36.8,46.32 36.69,46.2 36.23,46.2 v35.55,46.89
  Bottom 0.305: v21.72,30.32 21.72,10.08 21.37,9.74 T5.1 | v46.75,46.32 46.75,49.52 52.81,55.58 52.81,56.49 UNIV.9 | v35.55,46.89 35.55,48.6 31.89,52.26 31.89,54.43 U$1.P$14
IO15  (via drill 0.3)
  Top 0.305: v49.61,53.4 v52.23,53.4 | v45.25,45.4 45.25,42.61 v43.98,41.34
  Bottom 0.305: 45.26,52.95 U$1.P$23 | v52.23,53.4 UNIV.8 | v49.61,53.4 47.78,53.4 46.86,54.32 46.18,54.32 45.38,53.52 45.38,53.06 U$1.P$23 | U$1.P$23 45.26,45.16 v45.25,45.4 | T3.1 41.11,41.34 v43.98,41.34
IO27
  Top 0.305: R6.1 34.29,57.86 34.29,56.72 R5.2 34.18,57.06 31.89,57.06 U$1.P$12
ML-
  Top 1.016: ML.6 33.38,51.35 36.85,51.35 37.55,52.06 TB6612.0102
ML_IN1  (via drill 0.3)
  Top 0.305: v38.98,65.06 39.09,64.95 39.09,64.03 TB6612.21 | v44.46,57.98 48.46,57.98 49.38,57.06 49.72,57.06 U$1.P$27
  Bottom 0.305: v38.98,65.06 40.23,65.06 44.67,60.63 44.67,58.18 v44.46,57.98
ML_IN2
  Top 0.305: 49.38,58.66 49.72,58.32 U$1.P$28 49.15,58.27 47.59,59.83 44.97,59.83 44.36,59.17 39.22,59.17 38.19,60.2 38.19,61.59 38.52,61.93 TB6612.22
ML_PWM
  Top 0.305: TB6612.23 37.83,64.03 37.83,64.72 37.6,64.95 36.35,64.95 33.15,61.75 33.15,59.23 32.23,58.32 31.89,58.32 U$1.P$11
MR+
  Top 1.016: TB6612.1112 46.15,54.59 47.01,54.59 48.8,52.8 MR.1
MR-
  Top 1.016: MR.6 56.04,50.01 56.04,49.46 54.44,47.86 46.61,47.86 41.46,53.02 TB6612.0708
MR_IN1  (via drill 0.2, 0.3)
  Top 0.305: 49.49,60.49 49.72,60.72 U$1.P$30 49.71,60.9 45.25,60.9 v44.03,59.81 | 41.83,63.92 TB6612.17 41.77,62.76 41.69,62.68 v41.69,62.73
  Bottom 0.305: v41.69,62.73 43.95,60.47 43.95,59.91 v44.03,59.81
MR_IN2
  Top 0.305: TB6612.16 42.42,62.64 41.95,62.17 39.41,62.17 38.65,61.41 38.65,60.39 39.41,59.63 42.96,59.63 43.29,59.96 44.06,60.75 45.73,62.17 49.71,62.17 U$1.P$31
MR_PWM  (via drill 0.3)
  Top 0.305: v43.09,65.06 43.09,64.03 43.07,64.02 TB6612.15 | v33.26,63.58 v34.4,64.72
  Bottom 0.305: v43.09,65.06 40.92,65.06 39.66,66.32 36,66.32 v34.4,64.72 | v33.26,63.58 33.26,60.61 32.23,59.58 31.89,59.58 U$1.P$10
N$1  (via drill 1.02)
  other vias: 52.87,59.12
N$2  (via drill 1.02)
  other vias: 52.87,61.66
N$3
  Top 0.305: U$1.P$8 31.89,62.09 32.69,62.09 35.66,65.06 35.66,79.92 GY-530C.5
N$4
  Top 0.305: SJ1.2 35.78,31.69 35.78,31 36.12,30.66 37.15,30.66 37.72,31.23 37.72,31.57 38.98,32.83 45.49,32.83 47.09,34.43 GY-91.6
N$5
  Top 0.305: 49.83,69.75 U$1.P$37 49.95,69.75 51.78,69.75 52.69,70.66 62.18,70.66 64.12,72.61 GY-530R.5
N$6
  Top 0.305: 9.03,18.31 LED_RL.4-DIN | LED_FL.2-DOUT 21.49,72.84 20.23,74.09 16.8,74.09 6.17,63.46 6.17,54.89 7.31,53.75 9.22,53.75 11.42,51.55 11.42,31.59 10.29,30.47 10.29,20.1 9.05,18.86 arc45 8.96,18.64 LED_RL.4-DIN | 9.06,18.48 LED_RL.4-DIN
N$7  (via drill 0.3)
  Top 0.305: v37.26,65.63 36.92,65.98 36.92,68.61 38.75,70.44 40.23,70.44 41.15,69.52 R2.1 | v40.12,62.78 40.46,63.12 TB6612.19
  Bottom 0.305: v40.12,62.78 v37.26,65.63
N$8
  Top 0.305: U$1.P$13 31.78,55.8 25.95,55.8 25.83,55.92 BUZ+.1
N$9
  Top 0.305: LED_RR.4-DIN 69.38,14.54 16.8,14.54 14.75,16.6 LED_RL.2-DOUT
N$10  (via drill 1.02)
  other vias: 52.87,64.2
N$11  (via drill 1.02)
  other vias: 52.87,66.74
N$12  (via drill 1.02)
  other vias: 52.87,69.28
N$13  (via drill 1.02)
  other vias: 55.41,69.28
N$14  (via drill 1.02)
  other vias: 55.41,66.74
N$15  (via drill 0.3)
  Top 0.305: v69.61,32.94 69.61,51.69 71.89,53.98 71.89,61.98 69.95,63.92 69.95,65.52 70.75,66.32 70.75,68.38 63.55,75.58 61.84,75.58 LED_FR.4-DIN | v68.69,27.23 69.95,25.97 69.95,20.6 70.07,20.49 LED_RR.2-DOUT
  Bottom 0.305: v69.61,32.94 68.69,32.03 v68.69,27.23
N$16  (via drill 1.02)
  other vias: 55.41,64.2
N$17  (via drill 1.02)
  other vias: 55.41,61.66
N$18  (via drill 0.3)
  Top 0.305: v26.52,78.09 24.12,78.09 LED_FL.4-DIN | v36.35,65.63 v36.35,76.04
  Bottom 0.305: v26.52,78.09 28.57,76.04 v36.35,76.04 | v36.35,65.63 36.35,62.89 36,62.55 36,53.4 36.35,53.06 U$1.P$16
N$19
  Top 0.305: U$1.P$9 31.78,60.72 30.98,60.72 27.89,57.63 25.03,57.63 23.89,56.49 23.89,54.55 23.66,54.32 16.8,54.32 16.12,55 16.12,61.52 16.46,61.86 16.46,63.92 15.09,65.29 9.71,65.29 GY-530L.5
N$20  (via drill 1.02)
  other vias: 55.41,59.12
N$21  (via drill 1.02)
  other vias: 57.95,59.12
N$22  (via drill 1.02)
  other vias: 57.95,61.66
N$23  (via drill 1.02)
  other vias: 57.95,64.2
N$24  (via drill 1.02)
  other vias: 57.95,66.74
N$25  (via drill 1.02)
  other vias: 57.95,69.28
N$26  (via drill 1.02)
  other vias: 60.49,69.28
N$27  (via drill 1.02)
  other vias: 60.49,66.74
N$28  (via drill 1.02)
  other vias: 60.49,64.2
N$29  (via drill 1.02)
  other vias: 60.49,61.66
N$30  (via drill 1.02)
  other vias: 60.49,59.12
N$31  (via drill 1.02)
  other vias: 63.03,59.12
N$32  (via drill 1.02)
  other vias: 63.03,61.66
N$33  (via drill 1.02)
  other vias: 63.03,64.2
N$34  (via drill 1.02)
  other vias: 63.03,66.74
N$35  (via drill 1.02)
  other vias: 63.03,69.28
N$36  (via drill 1.02)
  other vias: 65.57,66.74
N$37  (via drill 1.02)
  other vias: 65.57,64.2
N$38
  Top 1.016: TB6612.0506 40.06,56.59 40.06,51.26 36.67,47.86 26.96,47.86 25.06,49.76 25.06,50.01 ML.1
N$39  (via drill 0.3)
  Top 0.305: R7.1 40.46,30.89 41.6,30.89 42.29,30.2 DMG3415U.1 42.52,30.09 43.55,30.09 v43.66,30.2
  Bottom 0.305: v43.66,30.2 43.66,5.51 42.86,4.71 SW1.A
N$40  (via drill 1.02)
  other vias: 65.57,61.66
N$41  (via drill 1.02)
  other vias: 65.57,59.12
N$42  (via drill 1.02)
  other vias: 68.11,59.12
N$43  (via drill 1.02)
  other vias: 68.11,61.66
N$44  (via drill 1.02)
  other vias: 68.11,64.2
N$45  (via drill 1.02)
  other vias: 70.65,61.66
N$46  (via drill 1.02)
  other vias: 70.65,59.12
N$47  (via drill 1.02)
  other vias: 73.19,59.12
N$48  (via drill 1.02)
  other vias: 73.19,61.66
N$49  (via drill 1.02)
  other vias: 52.87,71.82
N$50  (via drill 1.02)
  other vias: 55.41,71.82
RTS
  Top 0.305: 22.17,63.58 21.37,64.38 21.37,65.06 NDS9936.4 | 22.17,63.58 24.23,63.58 25.03,64.38 25.03,65.06 NDS9936.1 | SERIAL.2 18.75,59.23 18.75,60.03 22.17,63.46 22.17,63.58
RX
  Bottom 0.305: U$1.P$34 49.72,65.98 44.46,65.98 38.18,72.26 26.75,72.26 18.75,64.26 SERIAL.4
TX
  Bottom 0.305: U$1.P$35 49.72,67.12 46.98,67.12 46.63,66.78 44.35,66.78 38.4,72.72 26.4,72.72 20.57,66.89 18.75,66.89 SERIAL.5
VCC
  Top 0.025: 12.23,54.67 12.23,54.51 C2.1
  Top 0.305: IC2.8 12.13,56.53 12.18,56.53
  Top 1.016: IC2.5 8.27,57.93 8.62,58.28 8.93,58.28 8.94,58.29 11.66,58.29 12.08,57.87 IC2.8
  Top 1.524: 12.18,56.53 12.23,56.58 | C3.1 58.06,34.09 58.06,30.89 TA4805S.1 57.82,28.77 56.68,27.62 45.5,27.62 45.5,28.22 DMG3415U.3 44.57,28.25 44.62,28.2 44.62,26.18 43.14,24.7 26.57,24.7 25.57,24.7 25.52,24.7 19.85,30.37 19.85,44.51 14.14,50.23 14.14,52.5 C2.1 | 12.23,54.67 12.23,55.94 IC2.8
VDD  (via drill 0.61, 0.81)
  Top 0.305: R7.2 38.9,30.71 38.9,28.18 39.89,27.19 42.18,27.19 | DMG3415U.2 42.23,27.46 42.18,27.19 | 42.18,27.19 41.31,27.12 | TB6612.1314 44.74,63.94 44.74,63.95
  Top 0.406: TB6612.24 37.22,62.64 36.79,62.21 R6.2
  Top 1.016: 44.24,63.94 TB6612.1314 | 46.16,63.94 C10.1 | v36.92,62.09 36.79,62.21
  Top 1.524: v39.92,60.9 v41.44,60.9 42.48,60.9 44.24,62.66 44.24,63.94 | C10.1 46.16,63.95 44.74,63.95
  Top 3.048: 42.18,27.19 38.9,27.18 26.57,27.14 U$7.P$1
  Bottom 1.016: v36.92,62.09 38.63,62.09 39.43,61.29 40.68,60.39 40,60.95 v39.92,60.9 | 27.43,29.91 27.43,29.97 C8.+
  Bottom 3.048: U$7.P$1 27.43,29.91 28.74,29.91 31.28,32.45 31.28,38.8 40.68,48.2 40.68,60.39
  pour Top (no thermals): 37.38,63.56 37.38,62.04 37.38,61.79 37.12,61.53 36.23,61.53 36.23,63.18 36.49,63.44 36.49,64.58 37.38,64.58

### Text on the board
tPlace: DTR | RX | TX | 3V3 | TB6612 | RTS | IO15 | SDA | SCL | 3V3 | GND | IO12 | IO5 | IO2 | 5V | GND | M+ 3V3 A B GND M- | M+ 3V3 A B GND M- | GND